# EAGLE schematic schema_carte_mere (EAGLE 6.4)
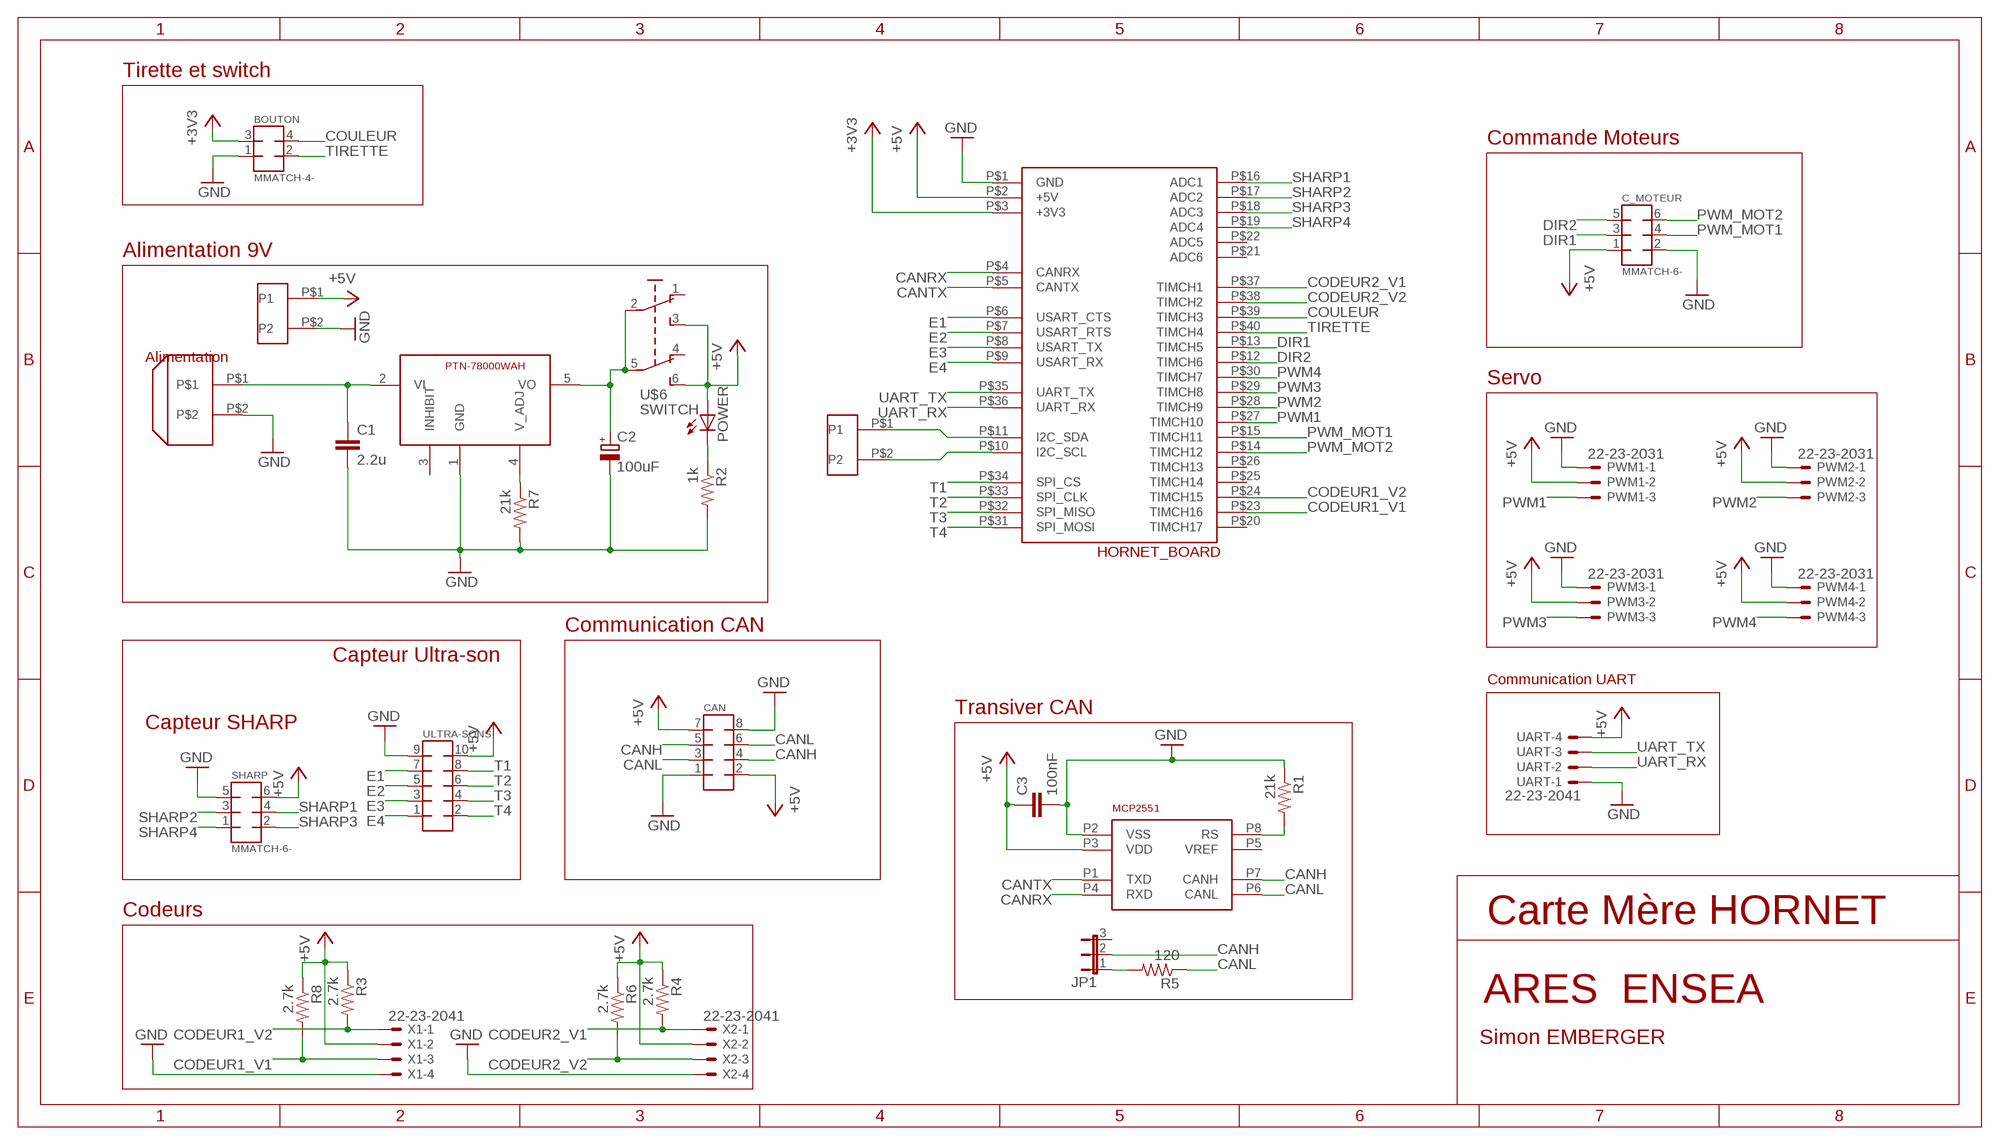
[diagram p0: schematic, sheet 1]

## Parts
ALIM  PM5.08_2  [PM5.08_2]
BOUTON  MMATCH-4-  [AMP-215079-4]
C1  2.2u  C-EUC1210  [C1210]
C2  100uF  CPOL-EU153CLV-0807  [153CLV-0807]
C3  100nF  C-EUC0805  [C0805]
C_MOTEUR  MMATCH-6-  [AMP-215079-6]
CAN  MMATCH-8-PTH  [AMP-215079-8]
JP1  JP2W  [JP2W]
PIN_ALIM  2_PIN  [2_PIN]
POWER  LEDCHIPLED_0805  [CHIPLED_0805]
PWM1  22-23-2031  [22-23-2031]
PWM2  22-23-2031  [22-23-2031]
PWM3  22-23-2031  [22-23-2031]
PWM4  22-23-2031  [22-23-2031]
R1  21k  R-US_M0805  [M0805]
R2  1k  R-US_M0805  [M0805]
R3  2.7k  R-US_M0805  [M0805]
R4  2.7k  R-US_M0805  [M0805]
R5  120  R-US_M0805  [M0805]
R6  2.7k  R-US_M0805  [M0805]
R7  21k  R-US_M0805  [M0805]
R8  2.7k  R-US_M0805  [M0805]
SHARP  MMATCH-6-  [AMP-215079-6]
U$1  HORNET_BOARD  [HORNET_EXT_20]
U$2  MCP2551  [SOIC_8]
U$3  2_PIN  [2_PIN]
U$6  SWITCH  [SWITCH]
U$18  PTN-78000WAH  [PCK-PTN-78000WAH]
UART  22-23-2041  [22-23-2041]
ULTRA-SONS  MMATCH-10-PTH  [AMP-215079-10]
X1  22-23-2041  [22-23-2041]
X2  22-23-2041  [22-23-2041]

## Nets
+3V3: BOUTON.3 U$1.P$3(+3V3)
+5V: C3.1 C_MOTEUR.1 CAN.2 CAN.7 PIN_ALIM.P$1(P1) POWER.A PWM1.2 PWM2.2 PWM3.2 PWM4.2 R3.1 R4.1 R6.1 R8.1 SHARP.6 U$1.P$2(+5V) U$2.P3(VDD) U$6.3(S) U$6.6(S1) UART.4 ULTRA-SONS.10 X1.2 X2.2
CANH: CAN.4 CAN.5 JP1.2 U$2.P7(CANH)
CANL: CAN.3 CAN.6 R5.1 U$2.P6(CANL)
CANRX: U$1.P$4(CANRX) U$2.P4(RXD)
CANTX: U$1.P$5(CANTX) U$2.P1(TXD)
CODEUR1_V1: R8.2 U$1.P$23(TIMCH16) X1.3
CODEUR1_V2: R3.2 U$1.P$24(TIMCH15) X1.1
CODEUR2_V1: R4.2 U$1.P$37(TIMCH1) X2.1
CODEUR2_V2: R6.2 U$1.P$38(TIMCH2) X2.3
COULEUR: BOUTON.4 U$1.P$39(TIMCH3)
DIR1: C_MOTEUR.3 U$1.P$13(TIMCH5)
DIR2: C_MOTEUR.5 U$1.P$12(TIMCH6)
E1: U$1.P$6(USART_CTS) ULTRA-SONS.7
E2: U$1.P$7(USART_RTS) ULTRA-SONS.5
E3: U$1.P$8(USART_TX) ULTRA-SONS.3
E4: U$1.P$9(USART_RX) ULTRA-SONS.1
GND: ALIM.P$2 BOUTON.1 C1.2 C2.- C3.2 C_MOTEUR.2 CAN.1 CAN.8 PIN_ALIM.P$2(P2) PWM1.1 PWM2.1 PWM3.1 PWM4.1 R1.1 R2.2 R7.2 SHARP.5 U$1.P$1(GND) U$2.P2(VSS) U$18.1(GND) UART.1 ULTRA-SONS.9 X1.4 X2.4
N$1: ALIM.P$1 C1.1 U$18.2(VI)
N$2: POWER.C R2.1
N$3: R1.2 U$2.P8(RS)
N$4: C2.+ U$6.2(P) U$6.5(P1) U$18.5(VO)
N$5: U$1.P$11(I2C_SDA) U$3.P$1(P1)
N$7: R7.1 U$18.4(V_ADJ)
N$9: JP1.1 R5.2
N$12: U$1.P$10(I2C_SCL) U$3.P$2(P2)
PWM1: PWM1.3 U$1.P$27(TIMCH10)
PWM2: PWM2.3 U$1.P$28(TIMCH9)
PWM3: PWM3.3 U$1.P$29(TIMCH8)
PWM4: PWM4.3 U$1.P$30(TIMCH7)
PWM_MOT1: C_MOTEUR.4 U$1.P$15(TIMCH11)
PWM_MOT2: C_MOTEUR.6 U$1.P$14(TIMCH12)
SHARP1: SHARP.4 U$1.P$16(ADC1)
SHARP2: SHARP.3 U$1.P$17(ADC2)
SHARP3: SHARP.2 U$1.P$18(ADC3)
SHARP4: SHARP.1 U$1.P$19(ADC4)
T1: U$1.P$34(SPI_CS) ULTRA-SONS.8
T2: U$1.P$33(SPI_CLK) ULTRA-SONS.6
T3: U$1.P$32(SPI_MISO) ULTRA-SONS.4
T4: U$1.P$31(SPI_MOSI) ULTRA-SONS.2
TIRETTE: BOUTON.2 U$1.P$40(TIMCH4)
UART_RX: U$1.P$36(UART_RX) UART.2
UART_TX: U$1.P$35(UART_TX) UART.3
Unconnected: JP1.3 U$1.P$20(TIMCH17) U$1.P$21(ADC6) U$1.P$22(ADC5) U$1.P$25(TIMCH14) U$1.P$26(TIMCH13) U$2.P5(VREF) U$6.1(O) U$6.4(O1) U$18.3(INHIBIT)

## Notes on the sheet
- Tirette et switch
- Commande Moteurs
- Alimentation 9V
- Alimentation
- Servo
- Communication CAN
- Capteur Ultra-son
- Communication UART
- Transiver CAN
- Capteur SHARP
- Codeurs
- Carte Mère HORNET
- ARES  ENSEA
- Simon EMBERGER

## Library data of the parts
ALIM = con_Weidmueller:PM5.08_2
BOUTON = jt-con-micromatch:MMATCH-4-*
C1 C3 = rcl:C-EU: CAPACITOR, European symbol
C2 = rcl:CPOL-EU: POLARIZED CAPACITOR, European symbol
C_MOTEUR SHARP = jt-con-micromatch:MMATCH-6-*
CAN = jt-con-micromatch:MMATCH-8-*: AMP Micromatch 8-pin
JP1 = jumper:JP2W: JUMPER
PIN_ALIM U$3 = con-HORNET:2_PIN
POWER = led:LED: LED OSRAM: - CHIPLED LG R971, LG N971, LY N971, LG Q971, LY Q971, LO R971, LY R971 LH N974, LH R974 LS Q976, LO Q976, LY Q976 LO Q996 - Hyper CHIPLED LW Q18S LB Q993, LB Q99A, LB R99A - SideLED LS A670, LO A670, LY A670, LG A670, LP A670 LB A673, LV A673, LT A673, LW A673 LH A674 LY A675 LS A676, LA A676, LO A676, LY A676, LW A676 LS A679, LY A679, LG A679 - Hyper Micro SIDELED® LS Y876, LA Y876, LO Y876, LY Y876 LT Y87S - SmartLED LW L88C, LW L88S LB L89C, LB L89S, LG L890 LS L89K, LO L89K, LY L89K LS L896, LA L896, LO L896, LY L896 - TOPLED LS T670, LO T670, LY T670, LG T670, LP T670 LSG T670, LSP T670, LSY T670, LOP T670, LYG T670 LG T671, LOG T671, LSG T671 LB T673, LV T673, LT T673, LW T673 LH T674 LS T676, LA T676, LO T676, LY T676, LB T676, LH T676, LSB T676, LW T676 LB T67C, LV T67C, LT T67C, LS T67K, LO T67K, LY T67K, LW E67C LS E67B, LA E67B, LO E67B, LY E67B, LB E67C, LV E67C, LT E67C LW T67C LS T679, LY T679, LG T679 LS T770, LO T770, LY T770, LG T770, LP T770 LB T773, LV T773, LT T773, LW T773 LH T774 LS E675, LA E675, LY E675, LS T675 LS T776, LA T776, LO T776, LY T776, LB T776 LHGB T686 LT T68C, LB T68C - Hyper Mini TOPLED® LB M676 - Mini TOPLED Santana® LG M470 LS M47K, LO M47K, LY M47K Source: http://www.osram.convergy.de LUXEON: - LUMILED® LXK2-PW12-R00, LXK2-PW12-S00, LXK2-PW14-U00, LXK2-PW14-V00 LXK2-PM12-R00, LXK2-PM12-S00, LXK2-PM14-U00 LXK2-PE12-Q00, LXK2-PE12-R00, LXK2-PE12-S00, LXK2-PE14-T00, LXK2-PE14-U00 LXK2-PB12-K00, LXK2-PB12-L00, LXK2-PB12-M00, LXK2-PB14-N00, LXK2-PB14-P00, LXK2-PB14-Q00 LXK2-PR12-L00, LXK2-PR12-M00, LXK2-PR14-Q00, LXK2-PR14-R00 LXK2-PD12-Q00, LXK2-PD12-R00, LXK2-PD12-S00 LXK2-PH12-R00, LXK2-PH12-S00 LXK2-PL12-P00, LXK2-PL12-Q00, LXK2-PL12-R00 Source: www.luxeon.com KINGBRIGHT: KA-3528ASYC Source: www.kingbright.com
PWM1-PWM4 = con-molex:22-23-2031: .100" (2.54mm) Center Header - 3 Pin; MF: MOLEX; MPN: 22-23-2031; OC_FARNELL: 1462950; OC_NEWARK: 30C0862
R1-R8 = rcl:R-US_: RESISTOR, American symbol
U$1 = con-HORNET:HORNET_BOARD
U$2 = microchip:MCP2551
U$6 = switch:SWITCH
U$18 = Ares_Library_Alimentation:PTN-78000WAH
UART X1 X2 = con-molex:22-23-2041: .100" (2.54mm) Center Header - 4 Pin; MF: MOLEX; MPN: 22-23-2041; OC_FARNELL: 1462920; OC_NEWARK: 38C0355
ULTRA-SONS = jt-con-micromatch:MMATCH-10-*: AMP Micromatch 10-pin